# Altium schematic sheet Socket.SchDoc
size A
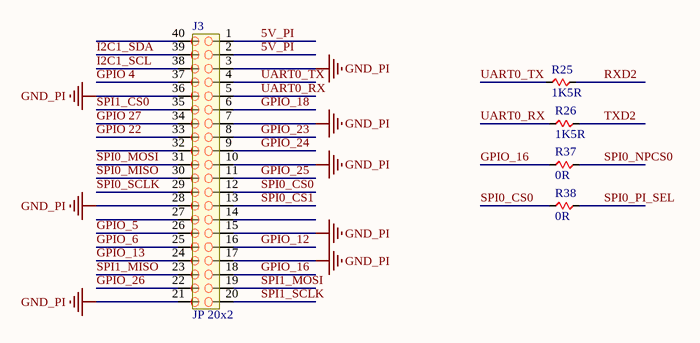
[diagram p0: Socket.SchDoc]

## Parts
J3  JP 20x2  [JP 20x2]
R25  1K5R  [R 0805]
R26  1K5R  [R 0805]
R37  0R  [R 0805]
R38  0R  [R 0805]

## Nets
GND_PI: J3.3 J3.7 J3.10 J3.15 J3.17 J3.21 J3.28 J3.36
5V_PI: J3.1 J3.2
GPIO 4: J3.37
GPIO 22: J3.33
GPIO 27: J3.34
GPIO_5: J3.26
GPIO_6: J3.25
GPIO_12: J3.16
GPIO_13: J3.24
GPIO_16: J3.18 R37.1
GPIO_18: J3.6
GPIO_23: J3.8
GPIO_24: J3.9
GPIO_25: J3.11
GPIO_26: J3.22
I2C1_SCL: J3.38
I2C1_SDA: J3.39
RXD2: R25.2
SPI0_CS0: J3.12 R38.1
SPI0_CS1: J3.13
SPI0_MISO: J3.30
SPI0_MOSI: J3.31
SPI0_NPCS0: R37.2
SPI0_PI_SEL: R38.2
SPI0_SCLK: J3.29
SPI1_CS0: J3.35
SPI1_MISO: J3.23
SPI1_MOSI: J3.19
SPI1_SCLK: J3.20
TXD2: R26.2
UART0_RX: J3.5 R26.1
UART0_TX: J3.4 R25.1

Not connected (* = marked no-connect by the designer): J3 14(19) 27(32) 32(37) 40(45)

## Library data of the parts
R25 R26 R37 R38 = R 0805